# Altium schematic sheet switch.SchDoc: High Side Switch
size A; Organization: Cal Poly Racing; engineer1: Graydon Wilson
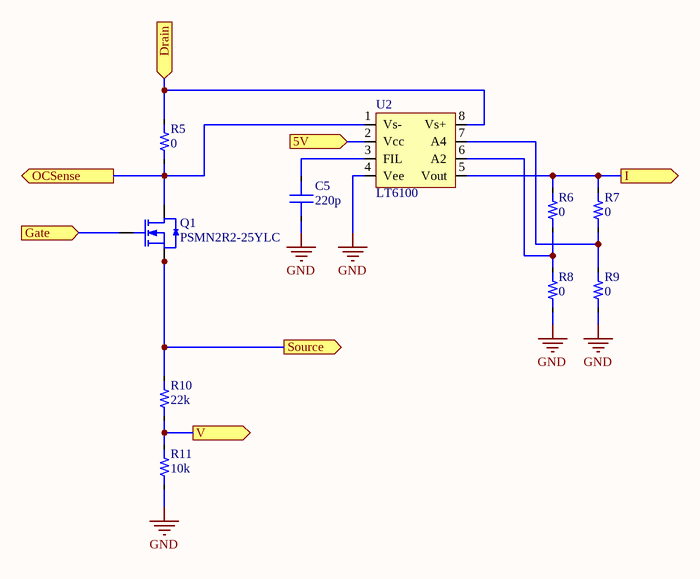
[diagram p0: switch.SchDoc]

## Parts
C5  value 220p  [0603_CAP]  (hidden comment: Capacitor)
Q1  PSMN2R2-25YLC  [LFPAK-SO8]
R5  value 0  [2010]  (hidden comment: Resistor)
R6  value 0  [0603_RES]  (hidden comment: Resistor)
R7  value 0  [0603_RES]  (hidden comment: Resistor)
R8  value 0  [0603_RES]  (hidden comment: Resistor)
R9  value 0  [0603_RES]  (hidden comment: Resistor)
R10  value 22k  [0603_RES]  (hidden comment: Resistor)
R11  value 10k  [0603_RES]  (hidden comment: Resistor)
U2  LT6100  [MSOP-8]

## Ports
5V (in), Drain (in), Gate (in), I (out), OCSense (out), Source (out), V (out)

## Nets
GND: C5.1 R8.1 R9.1 R11.1 U2.4(Vee)
5V: U2.2(Vcc) ; port 5V
Drain: R5.2 U2.8(Vs+) ; port Drain
Gate: Q1.4(G) ; port Gate
I: R6.2 R7.2 U2.5(Vout) ; port I
OCSense: Q1.5(D) R5.1 U2.1(Vs-) ; port OCSense
Source: Q1.1(S) Q1.2(S) Q1.3(S) R10.2 ; port Source
V: R10.1 R11.2 ; port V
NetC5_2: C5.2 U2.3(FIL)
NetR6_1: R6.1 R8.2 U2.6(A2)
NetR7_1: R7.1 R9.2 U2.7(A4)

## Notes on the sheet
- Date:
- Time:
- File:

## Library data of the parts
Q1 = PSMN2R2-25YLC: N-channel 25 V 2.4 mΩ logic level MOSFET in LFPAK using NextPower; Type: N; VdsMax: 25; IdsMax: 100; RdsOnMax: 3.15m; Vt: 1.54; VgsMax: 20; ComponentLink1Description: Datasheet; ComponentLink1URL: https://assets.nexperia.com/documents/data-sheet/PSMN2R2-25YLC.pdf; ComponentLink2Description: Digikey; ComponentLink2URL: https://www.digikey.com/product-detail/en/nexperia-usa-inc/PSMN2R2-25YLC115/1727-5299-1-ND/2674299; Name: PSMN2R2-25YLC
U2 = LT6100: High Side Current Sense Amp; Name: LT6100; ComponentLink1Description: Datasheet; ComponentLink1URL: https://www.analog.com/media/en/technical-documentation/data-sheets/6100fd.pdf; ComponentLink2Description: Digikey; ComponentLink2URL: https://www.digikey.com/product-detail/en/linear-technology-analog-devices/LT6100CMS8-TRPBF/LT6100CMS8-TRPBFCT-ND/7917234
C5 = Capacitor: Dielectric: *; Percent Tolerance: *; ESR: *
R5-R11 = Resistor: Tolerance: *